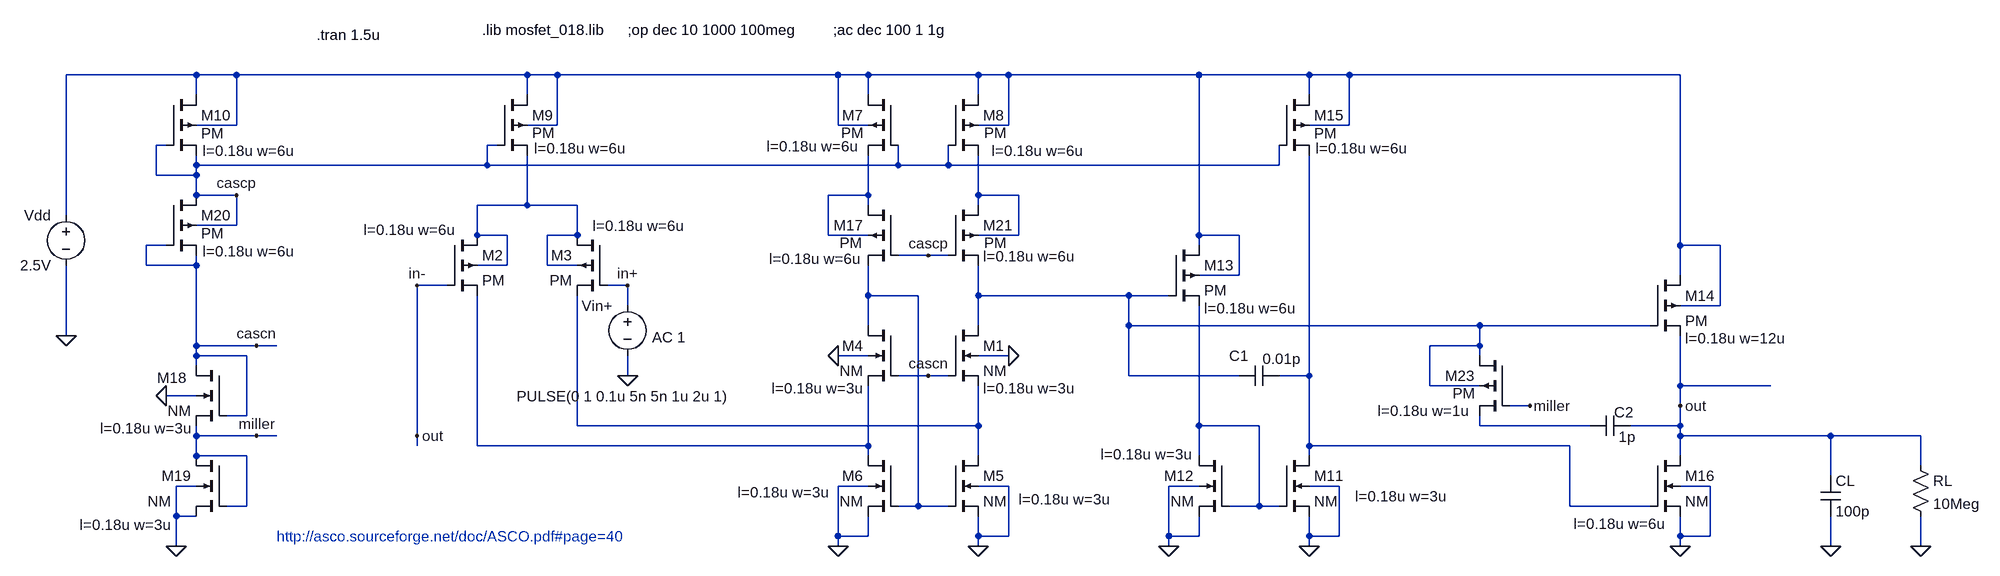
[diagram p0: schematic opamp_settling_time.asc]
opamp_settling_time.asc, the LTspice schematic file:
Version 4
SHEET 1 2676 760
WIRE -848 -112 -1056 -112
WIRE -784 -112 -848 -112
WIRE -320 -112 -784 -112
WIRE -272 -112 -320 -112
WIRE 176 -112 -272 -112
WIRE 224 -112 176 -112
WIRE 400 -112 224 -112
WIRE 448 -112 400 -112
WIRE 752 -112 448 -112
WIRE 928 -112 752 -112
WIRE 992 -112 928 -112
WIRE 1520 -112 992 -112
WIRE -848 -80 -848 -112
WIRE -320 -80 -320 -112
WIRE 224 -80 224 -112
WIRE 400 -80 400 -112
WIRE 928 -80 928 -112
WIRE -784 -32 -784 -112
WIRE -784 -32 -848 -32
WIRE -272 -32 -272 -112
WIRE -272 -32 -320 -32
WIRE 176 -32 176 -112
WIRE 224 -32 176 -32
WIRE 448 -32 448 -112
WIRE 448 -32 400 -32
WIRE 992 -32 992 -112
WIRE 992 -32 928 -32
WIRE -896 0 -912 0
WIRE -368 0 -384 0
WIRE -848 32 -848 16
WIRE -384 32 -384 0
WIRE -384 32 -848 32
WIRE 272 32 272 0
WIRE 272 32 -384 32
WIRE 352 32 352 0
WIRE 352 32 272 32
WIRE 880 32 880 0
WIRE 880 32 352 32
WIRE -912 48 -912 0
WIRE -848 48 -848 32
WIRE -848 48 -912 48
WIRE -848 80 -848 48
WIRE -784 80 -848 80
WIRE 224 80 224 16
WIRE 224 80 160 80
WIRE 400 80 400 16
WIRE 464 80 400 80
WIRE -320 96 -320 16
WIRE -320 96 -400 96
WIRE -240 96 -320 96
WIRE 224 96 224 80
WIRE 400 96 400 80
WIRE -1056 112 -1056 -112
WIRE -784 128 -784 80
WIRE -784 128 -848 128
WIRE -400 144 -400 96
WIRE -352 144 -400 144
WIRE -240 144 -240 96
WIRE -240 144 -288 144
WIRE 160 144 160 80
WIRE 224 144 160 144
WIRE 464 144 464 80
WIRE 464 144 400 144
WIRE 752 144 752 -112
WIRE 816 144 752 144
WIRE -896 160 -928 160
WIRE 752 160 752 144
WIRE 1520 160 1520 -112
WIRE 1584 160 1520 160
WIRE 320 176 272 176
WIRE 352 176 320 176
WIRE -928 192 -928 160
WIRE -848 192 -848 176
WIRE -848 192 -928 192
WIRE -352 192 -352 144
WIRE -352 192 -400 192
WIRE -288 192 -288 144
WIRE -240 192 -288 192
WIRE 816 208 816 144
WIRE 816 208 752 208
WIRE 1520 208 1520 160
WIRE -448 224 -496 224
WIRE -160 224 -192 224
WIRE 224 240 224 192
WIRE 304 240 224 240
WIRE 400 240 400 192
WIRE 640 240 400 240
WIRE 704 240 640 240
WIRE -160 256 -160 224
WIRE 1584 256 1584 160
WIRE 1584 256 1520 256
WIRE 224 288 224 240
WIRE 400 288 400 240
WIRE 640 288 640 240
WIRE 1200 288 640 288
WIRE 1472 288 1200 288
WIRE -1056 304 -1056 192
WIRE -848 320 -848 192
WIRE -752 320 -848 320
WIRE -720 320 -752 320
WIRE 1200 320 1200 288
WIRE 1200 320 1120 320
WIRE -848 336 -848 320
WIRE -768 336 -848 336
WIRE 224 336 176 336
WIRE 448 336 400 336
WIRE 1200 336 1200 320
WIRE -848 352 -848 336
WIRE -160 368 -160 336
WIRE 320 368 272 368
WIRE 352 368 320 368
WIRE 640 368 640 288
WIRE 816 368 640 368
WIRE 928 368 928 16
WIRE 928 368 880 368
WIRE 1120 384 1120 320
WIRE 1200 384 1120 384
WIRE 1520 384 1520 304
WIRE 1664 384 1520 384
WIRE -848 400 -896 400
WIRE 1280 416 1248 416
WIRE 1520 416 1520 384
WIRE -768 432 -768 336
WIRE -768 432 -800 432
WIRE -240 448 -240 240
WIRE 400 448 400 384
WIRE 400 448 -240 448
WIRE 752 448 752 256
WIRE 848 448 752 448
WIRE 1200 448 1200 432
WIRE 1376 448 1200 448
WIRE 1520 448 1520 416
WIRE 1520 448 1440 448
WIRE -848 464 -848 448
WIRE -752 464 -848 464
WIRE -720 464 -752 464
WIRE -496 464 -496 224
WIRE 1520 464 1520 448
WIRE 1760 464 1520 464
WIRE 1904 464 1760 464
WIRE -496 480 -496 464
WIRE -400 480 -400 240
WIRE 224 480 224 384
WIRE 224 480 -400 480
WIRE 928 480 928 368
WIRE 1344 480 928 480
WIRE -848 496 -848 464
WIRE -768 496 -848 496
WIRE 224 496 224 480
WIRE 400 496 400 448
WIRE 752 496 752 448
WIRE 928 496 928 480
WIRE 1520 496 1520 464
WIRE -848 512 -848 496
WIRE 1904 512 1904 464
WIRE 1760 528 1760 464
WIRE -848 544 -880 544
WIRE 224 544 176 544
WIRE 448 544 400 544
WIRE 752 544 704 544
WIRE 976 544 928 544
WIRE 1568 544 1520 544
WIRE -768 576 -768 496
WIRE -768 576 -800 576
WIRE 304 576 304 240
WIRE 304 576 272 576
WIRE 352 576 304 576
WIRE 848 576 848 448
WIRE 848 576 800 576
WIRE 880 576 848 576
WIRE 1344 576 1344 480
WIRE 1472 576 1344 576
WIRE -880 592 -880 544
WIRE -848 592 -880 592
WIRE 176 624 176 544
WIRE 224 624 224 592
WIRE 224 624 176 624
WIRE 400 624 400 592
WIRE 448 624 448 544
WIRE 448 624 400 624
WIRE 704 624 704 544
WIRE 752 624 752 592
WIRE 752 624 704 624
WIRE 928 624 928 592
WIRE 976 624 976 544
WIRE 976 624 928 624
WIRE 1520 624 1520 592
WIRE 1568 624 1568 544
WIRE 1568 624 1520 624
WIRE -880 640 -880 592
WIRE 176 640 176 624
WIRE 400 640 400 624
WIRE 704 640 704 624
WIRE 928 640 928 624
WIRE 1520 640 1520 624
WIRE 1760 640 1760 592
WIRE 1904 640 1904 592
FLAG 176 336 0
FLAG 448 336 0
FLAG 176 640 0
FLAG 400 640 0
FLAG -160 368 0
FLAG -1056 304 0
FLAG 704 640 0
FLAG 928 640 0
FLAG 1520 640 0
FLAG -880 640 0
FLAG -160 224 in+
FLAG -496 224 in-
FLAG 1520 416 out
FLAG -896 400 0
FLAG -752 464 miller
FLAG -752 320 cascn
FLAG -784 80 cascp
FLAG 320 368 cascn
FLAG 320 176 cascp
FLAG -496 464 out
FLAG 1760 640 0
FLAG 1904 640 0
FLAG 1280 416 miller
DATAFLAG 1616 384 ""
DATAFLAG 1376 288 ""
SYMBOL nmos4 352 288 R0
WINDOW 123 56 100 Left 2
SYMATTR Value2 l=0.18u w=3u
SYMATTR InstName M1
SYMATTR Value NM
SYMBOL pmos4 -448 144 R0
WINDOW 123 -133 -9 Left 2
SYMATTR Value2 l=0.18u w=6u
SYMATTR InstName M2
SYMATTR Value PM
SYMBOL pmos4 -192 144 M0
WINDOW 123 -122 -15 Left 2
SYMATTR Value2 l=0.18u w=6u
SYMATTR InstName M3
SYMATTR Value PM
SYMBOL nmos4 272 288 M0
WINDOW 123 56 100 Left 2
SYMATTR Value2 l=0.18u w=3u
SYMATTR InstName M4
SYMATTR Value NM
SYMBOL nmos4 352 496 R0
WINDOW 123 112 69 Left 2
SYMATTR Value2 l=0.18u w=3u
SYMATTR InstName M5
SYMATTR Value NM
SYMBOL nmos4 272 496 M0
WINDOW 123 111 58 Left 2
SYMATTR Value2 l=0.18u w=3u
SYMATTR InstName M6
SYMATTR Value NM
SYMBOL pmos4 272 -80 M0
WINDOW 3 55 60 Left 2
WINDOW 123 64 82 Left 2
SYMATTR Value PM
SYMATTR Value2 l=0.18u w=6u
SYMATTR InstName M7
SYMBOL pmos4 352 -80 R0
WINDOW 3 57 60 Left 2
WINDOW 123 69 89 Left 2
SYMATTR Value PM
SYMATTR Value2 l=0.18u w=6u
SYMATTR InstName M8
SYMBOL pmos4 -368 -80 R0
WINDOW 3 56 60 Left 2
WINDOW 123 59 85 Left 2
SYMATTR Value PM
SYMATTR Value2 l=0.18u w=6u
SYMATTR InstName M9
SYMBOL pmos4 -896 -80 R0
WINDOW 3 56 61 Left 2
WINDOW 123 58 89 Left 2
SYMATTR Value PM
SYMATTR Value2 l=0.18u w=6u
SYMATTR InstName M10
SYMBOL voltage -160 240 M0
WINDOW 123 -93 67 Left 2
WINDOW 39 0 0 Left 2
WINDOW 3 -161 161 Left 2
SYMATTR Value2 AC 1
SYMATTR Value PULSE(0 1 0.1u 5n 5n 1u 2u 1)
SYMATTR InstName Vin+
SYMBOL voltage -1056 96 M0
SYMATTR InstName Vdd
SYMATTR Value 2.5V
SYMBOL nmos4 880 496 R0
WINDOW 123 121 64 Left 2
SYMATTR Value2 l=0.18u w=3u
SYMATTR InstName M11
SYMATTR Value NM
SYMBOL nmos4 800 496 M0
WINDOW 123 59 -3 Left 2
SYMATTR Value2 l=0.18u w=3u
SYMATTR InstName M12
SYMATTR Value NM
SYMBOL pmos4 704 160 R0
WINDOW 123 56 100 Left 2
SYMATTR Value2 l=0.18u w=6u
SYMATTR InstName M13
SYMATTR Value PM
SYMBOL cap 880 352 R90
WINDOW 0 0 64 VBottom 2
WINDOW 3 -27 -4 VTop 2
SYMATTR InstName C1
SYMATTR Value 0.01p
SYMBOL pmos4 1472 208 R0
WINDOW 123 56 100 Left 2
SYMATTR Value2 l=0.18u w=12u
SYMATTR InstName M14
SYMATTR Value PM
SYMBOL cap 1440 432 R90
WINDOW 0 10 10 VBottom 2
WINDOW 3 18 5 VTop 2
SYMATTR InstName C2
SYMATTR Value 1p
SYMBOL pmos4 880 -80 R0
WINDOW 3 56 61 Left 2
WINDOW 123 58 85 Left 2
SYMATTR Value PM
SYMATTR Value2 l=0.18u w=6u
SYMATTR InstName M15
SYMBOL nmos4 1472 496 R0
WINDOW 123 -122 108 Left 2
SYMATTR Value2 l=0.18u w=6u
SYMATTR InstName M16
SYMATTR Value NM
SYMBOL nmos4 -800 352 M0
WINDOW 123 56 100 Left 2
WINDOW 0 63 19 Left 2
SYMATTR Value2 l=0.18u w=3u
SYMATTR InstName M18
SYMATTR Value NM
SYMBOL nmos4 -800 496 M0
WINDOW 123 89 110 Left 2
WINDOW 3 88 72 Left 2
SYMATTR Value2 l=0.18u w=3u
SYMATTR Value NM
SYMATTR InstName M19
SYMBOL pmos4 -896 80 R0
WINDOW 3 56 61 Left 2
WINDOW 123 58 89 Left 2
SYMATTR Value PM
SYMATTR Value2 l=0.18u w=6u
SYMATTR InstName M20
SYMBOL pmos4 272 96 M0
WINDOW 3 57 60 Left 2
WINDOW 123 60 85 Left 2
SYMATTR Value PM
SYMATTR Value2 l=0.18u w=6u
SYMATTR InstName M17
SYMBOL pmos4 352 96 R0
WINDOW 3 57 60 Left 2
WINDOW 123 56 81 Left 2
SYMATTR Value PM
SYMATTR Value2 l=0.18u w=6u
SYMATTR InstName M21
SYMBOL cap 1744 528 R0
SYMATTR InstName CL
SYMATTR Value 100p
SYMBOL res 1888 496 R0
SYMATTR InstName RL
SYMATTR Value 10Meg
SYMBOL pmos4 1248 336 M0
WINDOW 3 55 60 Left 2
WINDOW 123 65 88 Left 2
SYMATTR Value PM
SYMATTR Value2 l=0.18u w=1u
SYMATTR InstName M23
TEXT -656 -176 Left 2 !.tran 1.5u
TEXT -720 624 Left 2 ;http://asco.sourceforge.net/doc/ASCO.pdf#page=40
TEXT -392 -184 Left 2 !.lib mosfet_018.lib
TEXT -160 -184 Left 2 !;op dec 10 1000 100meg
TEXT 168 -184 Left 2 !;ac dec 100 1 1g

The netlist it stands for:
* opamp_settling_time.asc
M1 N006 cascn N008 0 NM l=0.18u w=3u
M2 N004 out N011 N004 PM l=0.18u w=6u
M3 N004 in+ N008 N004 PM l=0.18u w=6u
M4 N005 cascn N011 0 NM l=0.18u w=3u
M5 N008 N005 0 0 NM l=0.18u w=3u
M6 N011 N005 0 0 NM l=0.18u w=3u
M7 N001 cascp N002 N001 PM l=0.18u w=6u
M8 N001 cascp N003 N001 PM l=0.18u w=6u
M9 N001 cascp N004 N001 PM l=0.18u w=6u
M10 N001 cascp cascp N001 PM l=0.18u w=6u
Vin+ in+ 0 PULSE(0 1 0.1u 5n 5n 1u 2u 1) AC 1
Vdd N001 0 2.5V
M11 N007 N009 0 0 NM l=0.18u w=3u
M12 N009 N009 0 0 NM l=0.18u w=3u
M13 N001 N006 N009 N001 PM l=0.18u w=6u
C1 N007 N006 0.01p
M14 N001 N006 out N001 PM l=0.18u w=12u
C2 out N010 1p
M15 N001 cascp N007 N001 PM l=0.18u w=6u
M16 out N007 0 0 NM l=0.18u w=6u
M18 cascn cascn miller 0 NM l=0.18u w=3u
M19 miller miller 0 0 NM l=0.18u w=3u
M20 cascp cascn cascn cascp PM l=0.18u w=6u
M17 N002 cascp N005 N002 PM l=0.18u w=6u
M21 N003 cascp N006 N003 PM l=0.18u w=6u
CL out 0 100p
RL out 0 10Meg
M23 N006 miller N010 N006 PM l=0.18u w=1u
.model NMOS NMOS
.model PMOS PMOS
.lib standard.mos
.tran 1.5u
* http://asco.sourceforge.net/doc/ASCO.pdf#page=40
.lib mosfet_018.lib
;op dec 10 1000 100meg
;ac dec 100 1 1g
.backanno
.end